# EAGLE schematic ISO11446_TEST (EAGLE 9.6.2)
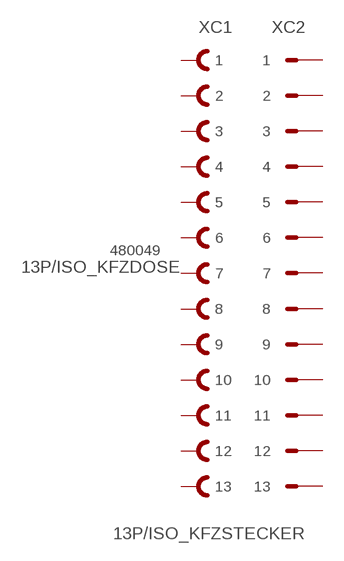
[diagram p0: schematic, sheet 1]

## Parts
XC1  13P/ISO_KFZDOSE  [13P/ISO_KFZDOSE]
XC2  13P/ISO_KFZSTECKER  [13P/ISO_KFZSTECKER]
Unconnected: XC1.1 XC1.2 XC1.3 XC1.4 XC1.5 XC1.6 XC1.7 XC1.8 XC1.9 XC1.10 XC1.11 XC1.12 XC1.13 XC2.1 XC2.2 XC2.3 XC2.4 XC2.5 XC2.6 XC2.7 XC2.8 XC2.9 XC2.10 XC2.11 XC2.12 XC2.13

## Library data of the parts
XC1 = ISO11446:13P/ISO_KFZDOSE: Steckdose 13-polig / 12 V; ARTIKEL_NR: 480049; KASTL_NR: ETZXXX915015
XC2 = ISO11446:13P/ISO_KFZSTECKER